# EAGLE schematic CFT-PB0-revD-TSSOP (EAGLE 5.11)
DRAWN_BY: Alexios; PROJECT_NAME: CFT Mini-Computer; REVISION: Rev J; SHEET_DESCRIPTION: But Termination and Buffering; SIMULATION_FILENAME: N/A; URL: http://www.bedroomlan.org/cft

## Sheet 1 of 5
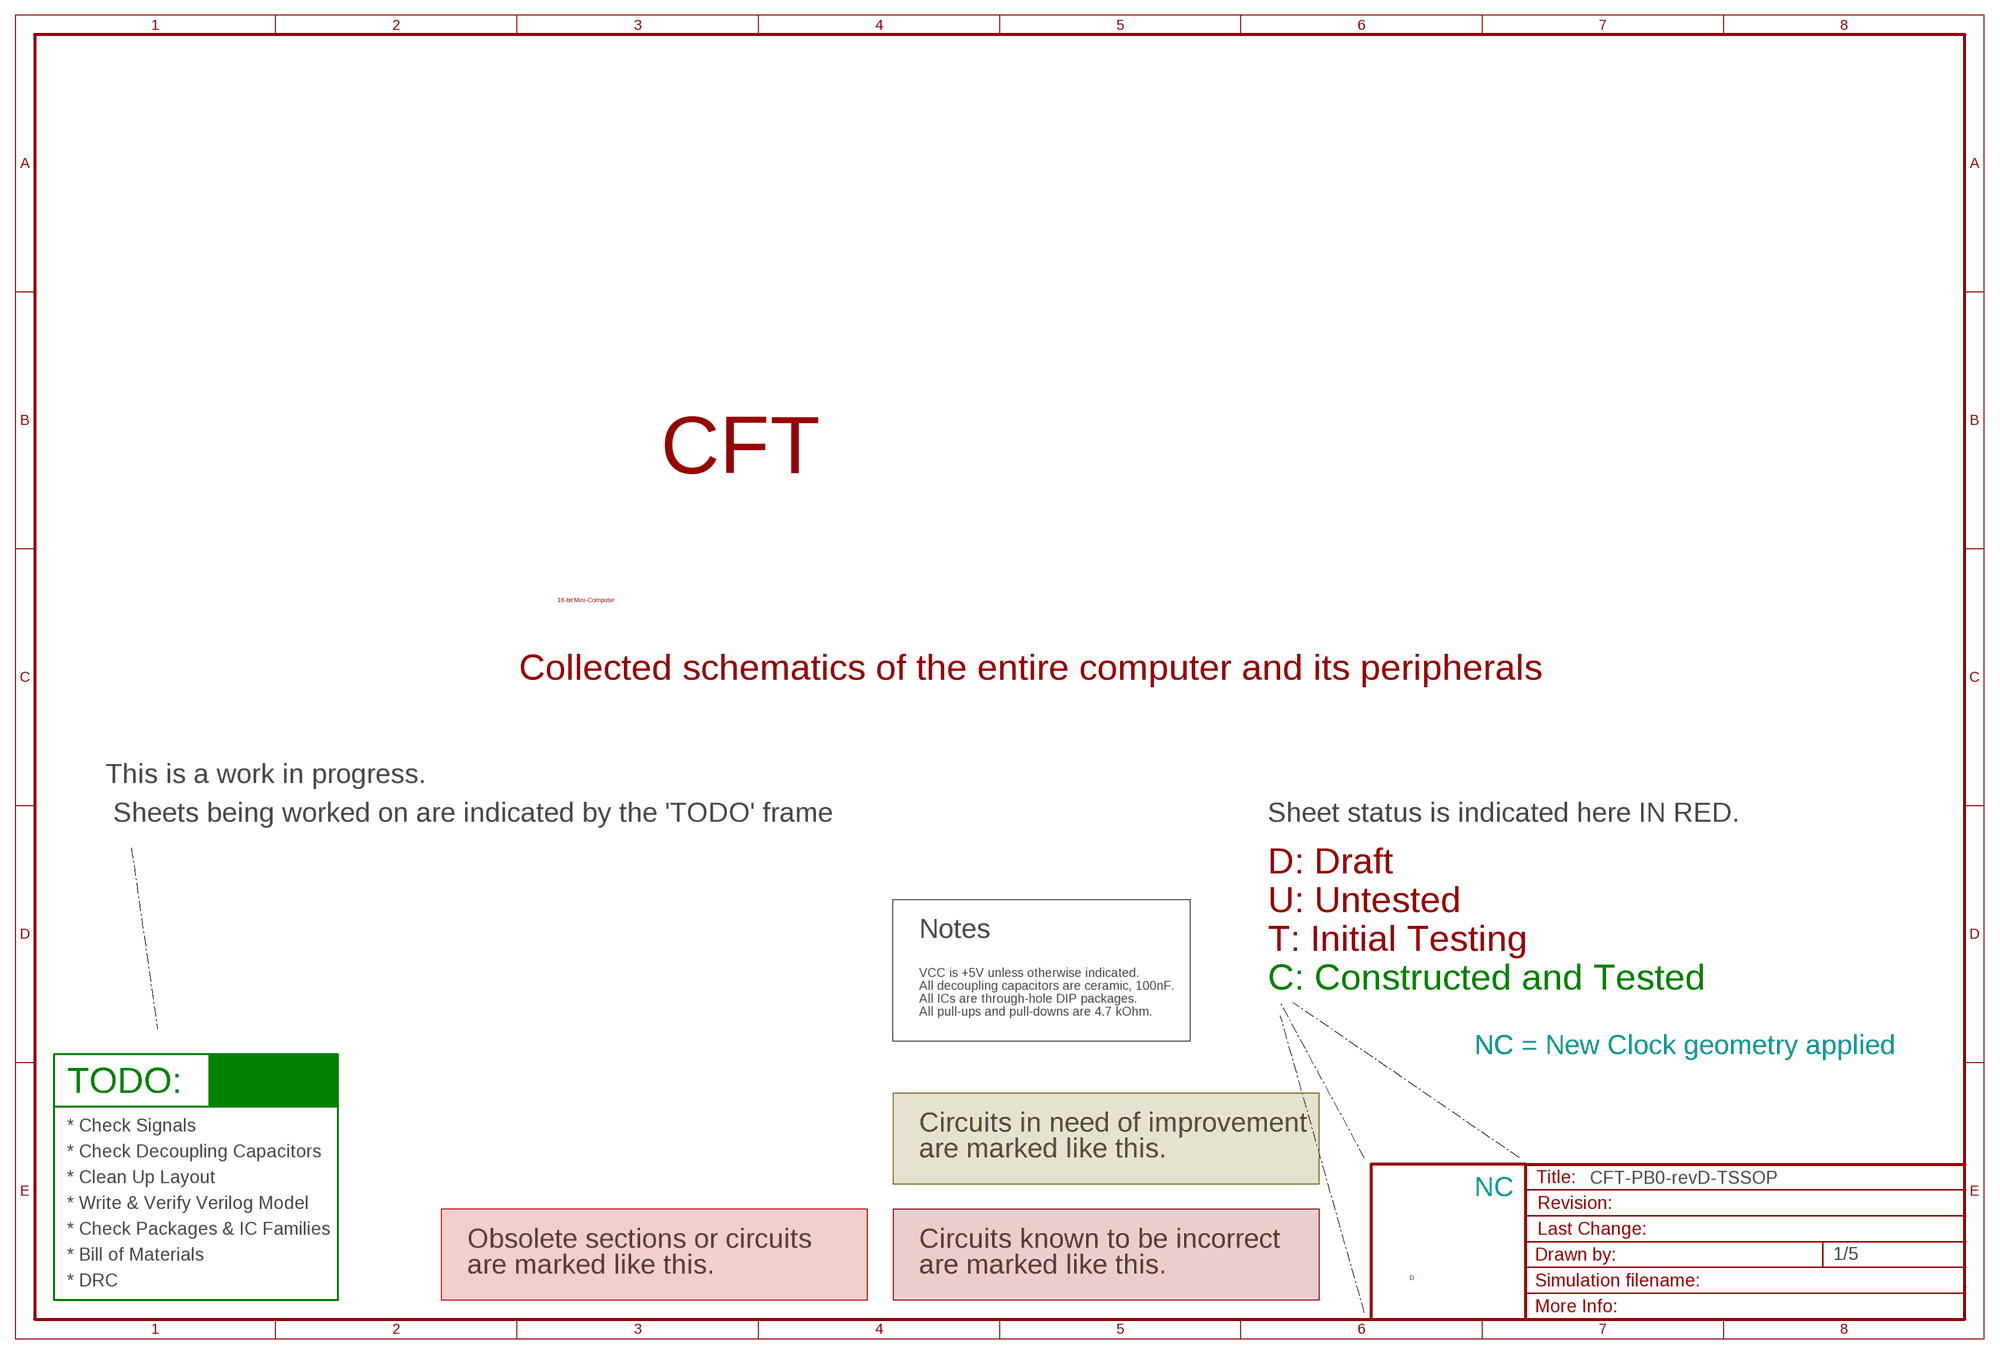
[diagram p0: schematic, sheet 1]

### Notes on the sheet
- CFT
- 16-bit Mini-Computer
- Collected schematics of the entire computer and its peripherals
- This is a work in progress.
- Sheets being worked on are indicated by the 'TODO' frame | Sheet status is indicated here IN RED.
- D: Draft
- U: Untested
- Notes
- T: Initial Testing
- VCC is +5V unless otherwise indicated.
- All decoupling capacitors are ceramic, 100nF. | C: Constructed and Tested
- All ICs are through-hole DIP packages.
- All pull-ups and pull-downs are 4.7 kOhm.
- NC | NC = New Clock geometry applied
- TODO:
- * Check Signals | Circuits in need of improvement
- * Check Decoupling Capacitors | are marked like this.
- * Clean Up Layout
- NC
- * Write & Verify Verilog Model
- * Check Packages & IC Families
- Obsolete sections or circuits | Circuits known to be incorrect
- * Bill of Materials
- are marked like this. | are marked like this.
- D
- * DRC

## Sheet 2 of 5
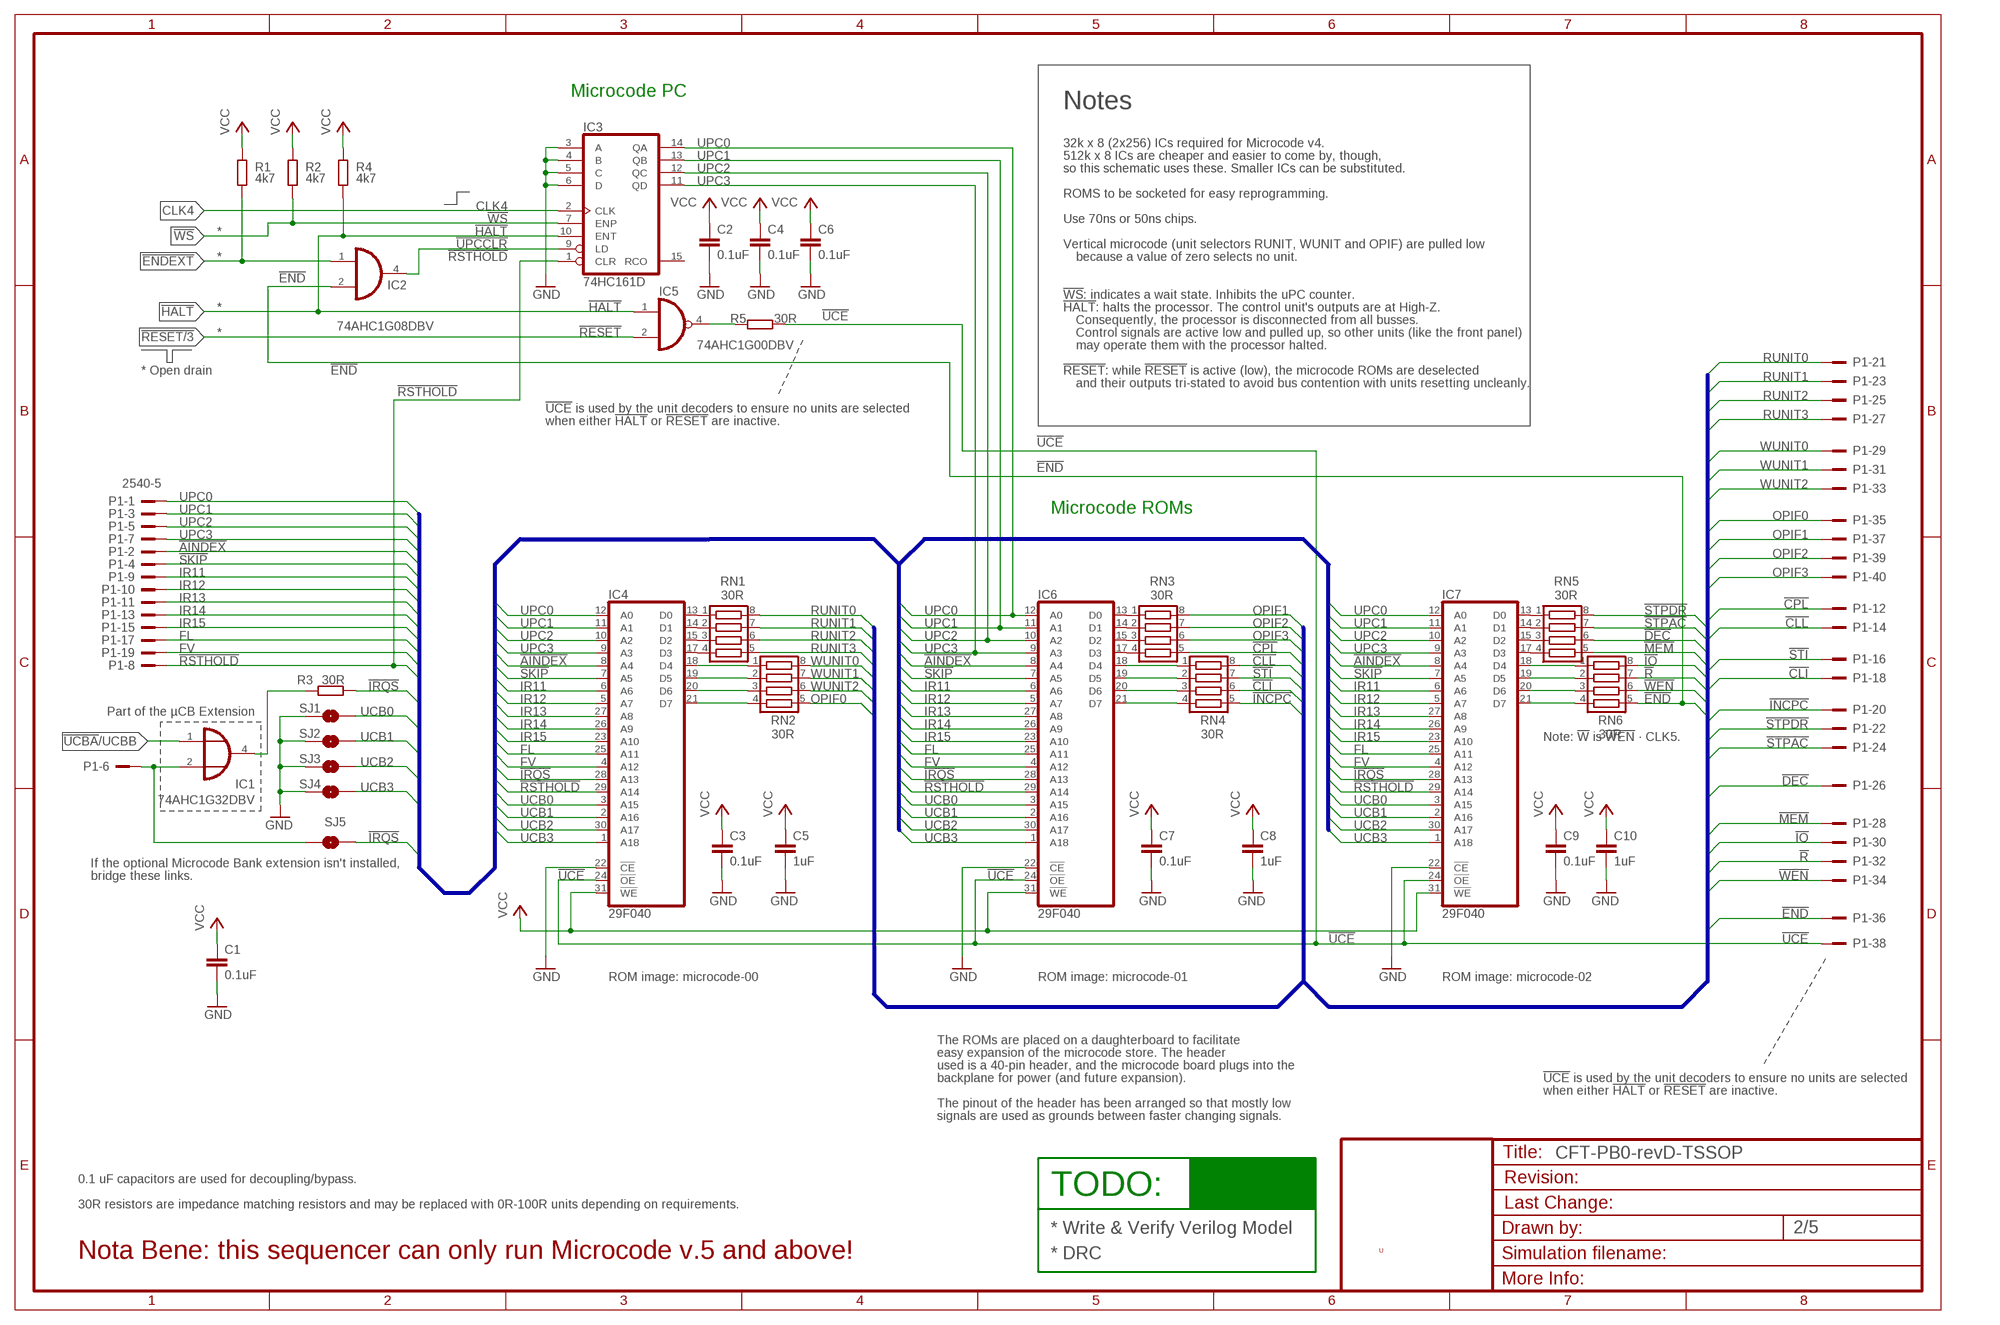
[diagram p1: schematic, sheet 2]

### Parts
C1  0.1uF  C-EUC0805K  [C0805K]
C2  0.1uF  C-EUC0805K  [C0805K]
C3  0.1uF  C-EUC0805K  [C0805K]
C4  0.1uF  C-EUC0805K  [C0805K]
C5  1uF  C-EUC0805K  [C0805K]
C6  0.1uF  C-EUC0805K  [C0805K]
C7  0.1uF  C-EUC0805K  [C0805K]
C8  1uF  C-EUC0805K  [C0805K]
C9  0.1uF  C-EUC0805K  [C0805K]
C10  1uF  C-EUC0805K  [C0805K]
IC1  74AHC1G32DBV  [SOT23-5]
IC2  74AHC1G08DBV  [SOT23-5]
IC3  74HC161D  [SO16D]
IC4  29F040  29F040PLCC32  [PLCC32]
IC5  74AHC1G00DBV  [SOT23-5]
IC6  29F040  29F040PLCC32  [PLCC32]
IC7  29F040  29F040PLCC32  [PLCC32]
P1  2540-5  [PAK100/2500-5-40]
R1  4k7  R-EU_R0805  [R0805]
R2  4k7  R-EU_R0805  [R0805]
R3  30R  R-EU_R0805  [R0805]
R4  4k7  R-EU_R0805  [R0805]
R5  30R  R-EU_R0805  [R0805]
RN1  30R  CTS742C083  [CTS742C083]
RN2  30R  CTS742C083  [CTS742C083]
RN3  30R  CTS742C083  [CTS742C083]
RN4  30R  CTS742C083  [CTS742C083]
RN5  30R  CTS742C083  [CTS742C083]
RN6  30R  CTS742C083  [CTS742C083]
SJ1  SOLDERJUMPER-OLDNO  [SJ_2S-NO]
SJ2  SOLDERJUMPER-OLDNO  [SJ_2S-NO]
SJ3  SOLDERJUMPER-OLDNO  [SJ_2S-NO]
SJ4  SOLDERJUMPER-OLDNO  [SJ_2S-NO]
SJ5  SOLDERJUMPER-OLDNO  [SJ_2S-NO]

### Nets
!AINDEX: IC4.8(A4) IC6.8(A4) IC7.8(A4) P1.2 ; also sheet 4
!CLI: P1.18 RN4.6 ; also sheet 4
!CLL: P1.14 RN4.8 ; also sheet 4
!CPL: P1.12 RN3.5 ; also sheet 4
!DEC: P1.26 RN5.6 ; also sheet 4
!END: IC2.2(I1) P1.36 RN6.5 ; also sheet 3,4
!ENDEXT: IC2.1(I0) R1.1 ; also sheet 5
!HALT: IC3.10(ENT) IC5.1(I0) R4.1 ; also sheet 5
!INCPC: P1.20 RN4.5 ; also sheet 4
!IO: P1.30 RN6.8 ; also sheet 4,5
!IRQS: IC4.28(A13) IC6.28(A13) IC7.28(A13) R3.2 SJ5.1 ; also sheet 4,5
!MEM: P1.28 RN5.5 ; also sheet 4,5
!R: P1.32 RN6.7 ; also sheet 4,5
!RESET: IC5.2(I1) ; also sheet 3,5
!RSTHOLD: IC3.1(CLR) IC4.29(A14) IC6.29(A14) IC7.29(A14) P1.8 ; also sheet 4
!SKIP: IC4.7(A5) IC6.7(A5) IC7.7(A5) P1.4 ; also sheet 4
!STI: P1.16 RN4.7 ; also sheet 4
!STPAC: P1.24 RN5.7 ; also sheet 4
!STPDR: P1.22 RN5.8 ; also sheet 4
!UCBA!/UCBB: IC1.1(I0) ; also sheet 3
!UCE: IC4.24(!OE) IC6.24(!OE) IC7.24(!OE) P1.38 R5.2
!UPCCLR: IC2.4(O) IC3.9(LD)
!WEN: P1.34 RN6.6 ; also sheet 4
!WS: IC3.7(ENP) R2.1 ; also sheet 5
CLK4: IC3.2(CLK) ; also sheet 4,5
FL: IC4.25(A11) IC6.25(A11) IC7.25(A11) P1.17 ; also sheet 4
FV: IC4.4(A12) IC6.4(A12) IC7.4(A12) P1.19 ; also sheet 4
GND [low power]: C1.2 C2.2 C3.2 C4.2 C5.2 C6.2 C7.2 C8.2 C9.2 C10.2 IC3.3(A) IC3.4(B) IC3.5(C) IC3.6(D) IC4.22(!CE) IC6.22(!CE) IC7.22(!CE) SJ1.1 SJ2.1 SJ3.1 SJ4.1 ; also sheet 3,4,5
IR11: IC4.6(A6) IC6.6(A6) IC7.6(A6) P1.9
IR12: IC4.5(A7) IC6.5(A7) IC7.5(A7) P1.10
IR13: IC4.27(A8) IC6.27(A8) IC7.27(A8) P1.11
IR14: IC4.26(A9) IC6.26(A9) IC7.26(A9) P1.13
IR15: IC4.23(A10) IC6.23(A10) IC7.23(A10) P1.15
N$45: IC5.4(O) R5.1
N$46: IC4.14(D1) RN1.2
N$47: IC1.4(O) R3.1
N$48: IC1.2(I1) P1.6 SJ5.2
N$49: IC4.15(D2) RN1.3
N$50: IC4.17(D3) RN1.4
N$51: IC4.13(D0) RN1.1
N$52: IC4.19(D5) RN2.2
N$53: IC4.20(D6) RN2.3
N$54: IC4.21(D7) RN2.4
N$55: IC4.18(D4) RN2.1
N$56: IC6.14(D1) RN3.2
N$57: IC6.15(D2) RN3.3
N$58: IC6.17(D3) RN3.4
N$59: IC6.13(D0) RN3.1
N$60: IC6.19(D5) RN4.2
N$61: IC7.14(D1) RN5.2
N$62: IC7.15(D2) RN5.3
N$63: IC7.17(D3) RN5.4
N$64: IC7.13(D0) RN5.1
N$65: IC7.19(D5) RN6.2
N$66: IC7.20(D6) RN6.3
N$67: IC7.21(D7) RN6.4
N$68: IC7.18(D4) RN6.1
N$69: IC6.20(D6) RN4.3
N$70: IC6.21(D7) RN4.4
N$71: IC6.18(D4) RN4.1
OPIF0: P1.35 RN2.5 ; also sheet 4
OPIF1: P1.37 RN3.8 ; also sheet 4
OPIF2: P1.39 RN3.7 ; also sheet 4
OPIF3: P1.40 RN3.6 ; also sheet 4
RUNIT0: P1.21 RN1.8 ; also sheet 4
RUNIT1: P1.23 RN1.7 ; also sheet 4
RUNIT2: P1.25 RN1.6 ; also sheet 4
RUNIT3: P1.27 RN1.5 ; also sheet 4
UCB0: IC4.3(A15) IC6.3(A15) IC7.3(A15) SJ1.2 ; also sheet 3,4
UCB1: IC4.2(A16) IC6.2(A16) IC7.2(A16) SJ2.2 ; also sheet 3,4
UCB2: IC4.30(A17) IC6.30(A17) IC7.30(A17) SJ3.2 ; also sheet 3,4
UCB3: IC4.1(A18) IC6.1(A18) IC7.1(A18) SJ4.2 ; also sheet 3,4
UPC0: IC3.14(QA) IC4.12(A0) IC6.12(A0) IC7.12(A0) P1.1 ; also sheet 4
UPC1: IC3.13(QB) IC4.11(A1) IC6.11(A1) IC7.11(A1) P1.3 ; also sheet 4
UPC2: IC3.12(QC) IC4.10(A2) IC6.10(A2) IC7.10(A2) P1.5 ; also sheet 4
UPC3: IC3.11(QD) IC4.9(A3) IC6.9(A3) IC7.9(A3) P1.7 ; also sheet 4
VCC [low power]: C1.1 C2.1 C3.1 C4.1 C5.1 C6.1 C7.1 C8.1 C9.1 C10.1 IC4.31(!WE) IC6.31(!WE) IC7.31(!WE) R1.2 R2.2 R4.2 ; also sheet 3,4,5
WUNIT0: P1.29 RN2.8 ; also sheet 4
WUNIT1: P1.31 RN2.7 ; also sheet 4
WUNIT2: P1.33 RN2.6 ; also sheet 4
Unconnected: IC3.15(RCO)

### Buses
MCINSTR:RUNIT[0..3],WUNIT[0..2],OPIF[0..3],!CPL,!CLL,!STI,!CLI,!INCPC,!STPDR,!STPAC,!DEC,!MEM,!IO,!R,!W,!END
MCADDR:UPC[0..3],!AINDEX,!SKIP,IR[11..15],FL,FV,!IRQS,!RSTHOLD,UCB[0..3]

### Notes on the sheet
- Microcode PC
- Notes
- 32k x 8 (2x256) ICs required for Microcode v4.
- 512k x 8 ICs are cheaper and easier to come by, though,
- so this schematic uses these. Smaller ICs can be substituted.
- ROMS to be socketed for easy reprogramming.
- Use 70ns or 50ns chips.
- *
- Vertical microcode (unit selectors RUNIT, WUNIT and OPIF) are pulled low
- * | because a value of zero selects no unit.
- !WS!: indicates a wait state. Inhibits the uPC counter.
- * | !HALT!: halts the processor. The control unit's outputs are at High-Z.
- Consequently, the processor is disconnected from all busses.
- * | Control signals are active low and pulled up, so other units (like the front panel)
- may operate them with the processor halted.
- * Open drain | !RESET!: while !RESET! is active (low), the microcode ROMs are deselected
- and their outputs tri-stated to avoid bus contention with units resetting uncleanly.
- !UCE! is used by the unit decoders to ensure no units are selected
- when either !HALT! or !RESET! are inactive.
- Microcode ROMs
- Part of the µCB Extension
- Note: !W! is !WEN! · CLK5.
- If the optional Microcode Bank extension isn't installed,
- bridge these links.
- ROM image: microcode-00 | ROM image: microcode-01 | ROM image: microcode-02
- The ROMs are placed on a daughterboard to facilitate
- easy expansion of the microcode store. The header
- used is a 40-pin header, and the microcode board plugs into the
- backplane for power (and future expansion). | !UCE! is used by the unit decoders to ensure no units are selected
- when either !HALT! or !RESET! are inactive.
- The pinout of the header has been arranged so that mostly low
- signals are used as grounds between faster changing signals.
- 0.1 uF capacitors are used for decoupling/bypass.
- TODO:
- 30R resistors are impedance matching resistors and may be replaced with 0R-100R units depending on requirements.
- * Write & Verify Verilog Model
- U
- Nota Bene: this sequencer can only run Microcode v.5 and above! | * DRC

## Sheet 3 of 5
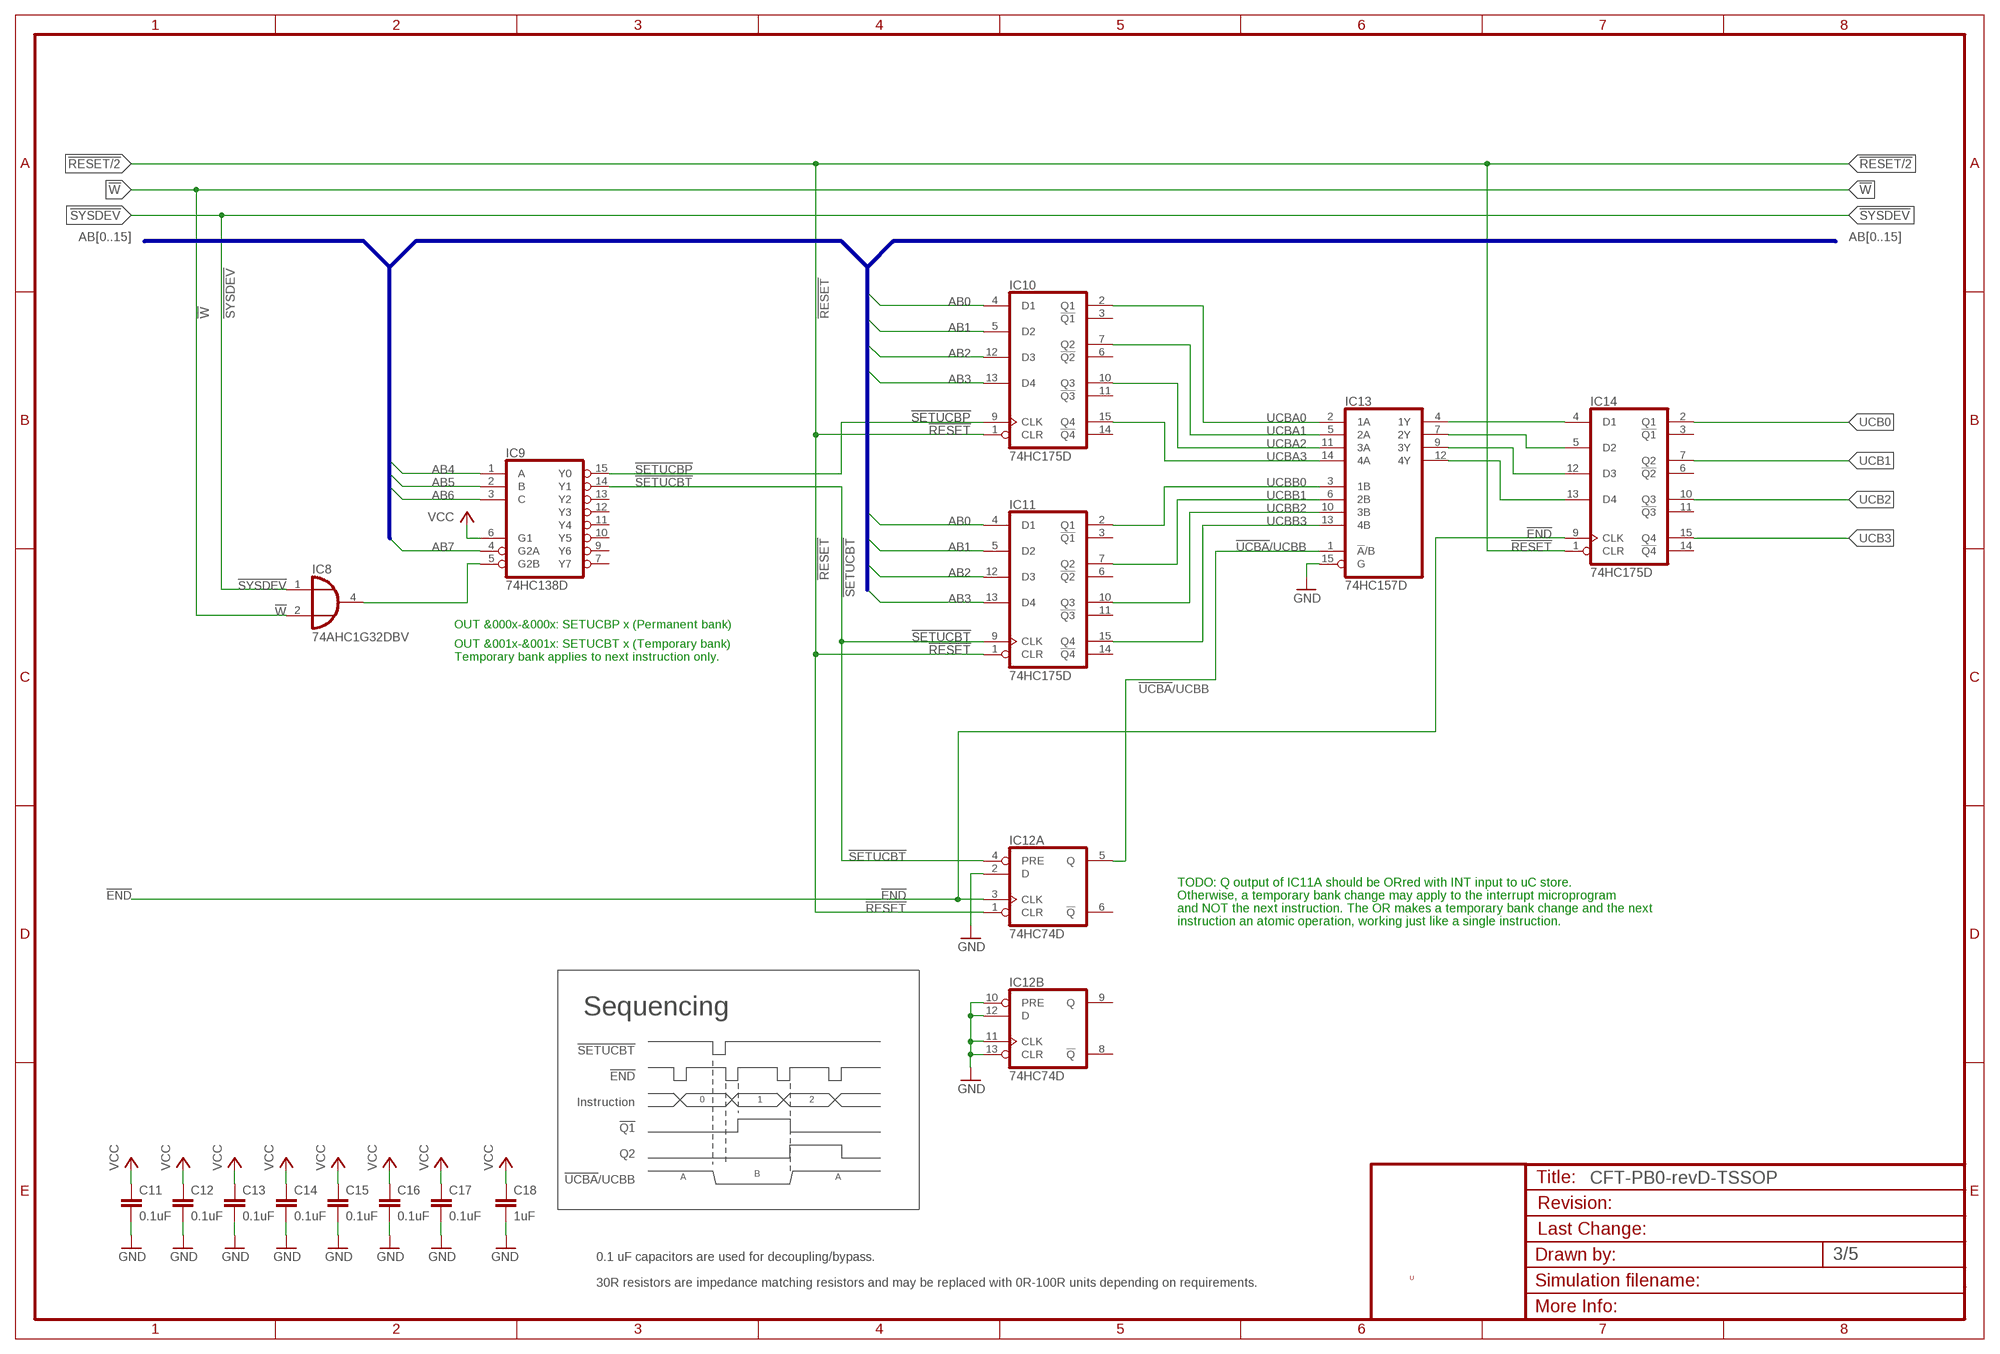
[diagram p2: schematic, sheet 3]

### Parts
C11  0.1uF  C-EUC0805K  [C0805K]
C12  0.1uF  C-EUC0805K  [C0805K]
C13  0.1uF  C-EUC0805K  [C0805K]
C14  0.1uF  C-EUC0805K  [C0805K]
C15  0.1uF  C-EUC0805K  [C0805K]
C16  0.1uF  C-EUC0805K  [C0805K]
C17  0.1uF  C-EUC0805K  [C0805K]
C18  1uF  C-EUC0805K  [C0805K]
IC8  74AHC1G32DBV  [SOT23-5]
IC9  74HC138D  [SO16]
IC10  74HC175D  [SO16]
IC11  74HC175D  [SO16]
IC12  74HC74D  [SO14]
IC13  74HC157D  74HC157/ALT-D  [SO16]
IC14  74HC175D  [SO16]

### Nets
!END: IC12.3(A:CLK) IC14.9(CLK) ; also sheet 2,4
!RESET: IC10.1(CLR) IC11.1(CLR) IC12.1(A:CLR) IC14.1(CLR) ; also sheet 2,5
!SETUCBP: IC9.15(Y0) IC10.9(CLK)
!SETUCBT: IC9.14(Y1) IC11.9(CLK) IC12.4(A:PRE)
!SYSDEV: IC8.1(I0) ; also sheet 4,5
!UCBA!/UCBB: IC12.5(A:Q) IC13.1(!A!/B) ; also sheet 2
!W: IC8.2(I1) ; also sheet 4,5
AB0: IC10.4(D1) IC11.4(D1) ; also sheet 4,5
AB1: IC10.5(D2) IC11.5(D2) ; also sheet 4,5
AB2: IC10.12(D3) IC11.12(D3) ; also sheet 4,5
AB3: IC10.13(D4) IC11.13(D4) ; also sheet 4,5
AB4: IC9.1(A) ; also sheet 4,5
AB5: IC9.2(B) ; also sheet 4,5
AB6: IC9.3(C) ; also sheet 4,5
AB7: IC9.4(G2A) ; also sheet 4,5
GND [low power]: C11.2 C12.2 C13.2 C14.2 C15.2 C16.2 C17.2 C18.2 IC12.2(A:D) IC12.10(B:PRE) IC12.11(B:CLK) IC12.12(B:D) IC12.13(B:CLR) IC13.15(G) ; also sheet 2,4,5
N$1: IC8.4(O) IC9.5(G2B)
N$2: IC13.4(1Y) IC14.4(D1)
N$3: IC13.7(2Y) IC14.5(D2)
N$4: IC13.9(3Y) IC14.12(D3)
N$5: IC13.12(4Y) IC14.13(D4)
UCB0: IC14.2(Q1) ; also sheet 2,4
UCB1: IC14.7(Q2) ; also sheet 2,4
UCB2: IC14.10(Q3) ; also sheet 2,4
UCB3: IC14.15(Q4) ; also sheet 2,4
UCBA0: IC10.2(Q1) IC13.2(1A)
UCBA1: IC10.7(Q2) IC13.5(2A)
UCBA2: IC10.10(Q3) IC13.11(3A)
UCBA3: IC10.15(Q4) IC13.14(4A)
UCBB0: IC11.2(Q1) IC13.3(1B)
UCBB1: IC11.7(Q2) IC13.6(2B)
UCBB2: IC11.10(Q3) IC13.10(3B)
UCBB3: IC11.15(Q4) IC13.13(4B)
VCC [low power]: C11.1 C12.1 C13.1 C14.1 C15.1 C16.1 C17.1 C18.1 IC9.6(G1) ; also sheet 2,4,5
Unconnected: IC9.7(Y7) IC9.9(Y6) IC9.10(Y5) IC9.11(Y4) IC9.12(Y3) IC9.13(Y2) IC10.3(!Q1) IC10.6(!Q2) IC10.11(!Q3) IC10.14(!Q4) IC11.3(!Q1) IC11.6(!Q2) IC11.11(!Q3) IC11.14(!Q4) IC12.6(A:!Q) IC12.8(B:!Q) IC12.9(B:Q) IC14.3(!Q1) IC14.6(!Q2) IC14.11(!Q3) IC14.14(!Q4)

### Buses
AB[0..15]

### Notes on the sheet
- OUT &000x-&000x: SETUCBP x (Permanent bank)
- OUT &001x-&001x: SETUCBT x (Temporary bank)
- Temporary bank applies to next instruction only.
- TODO: Q output of IC11A should be ORred with INT input to uC store.
- Otherwise, a temporary bank change may apply to the interrupt microprogram
- and NOT the next instruction. The OR makes a temporary bank change and the next
- instruction an atomic operation, working just like a single instruction.
- Sequencing
- !SETUCBT
- !END
- 0 | 1 | 2
- Instruction
- !Q1
- Q2
- B
- A | A
- !UCBA!/UCBB
- 0.1 uF capacitors are used for decoupling/bypass.
- U
- 30R resistors are impedance matching resistors and may be replaced with 0R-100R units depending on requirements.

## Sheet 4 of 5
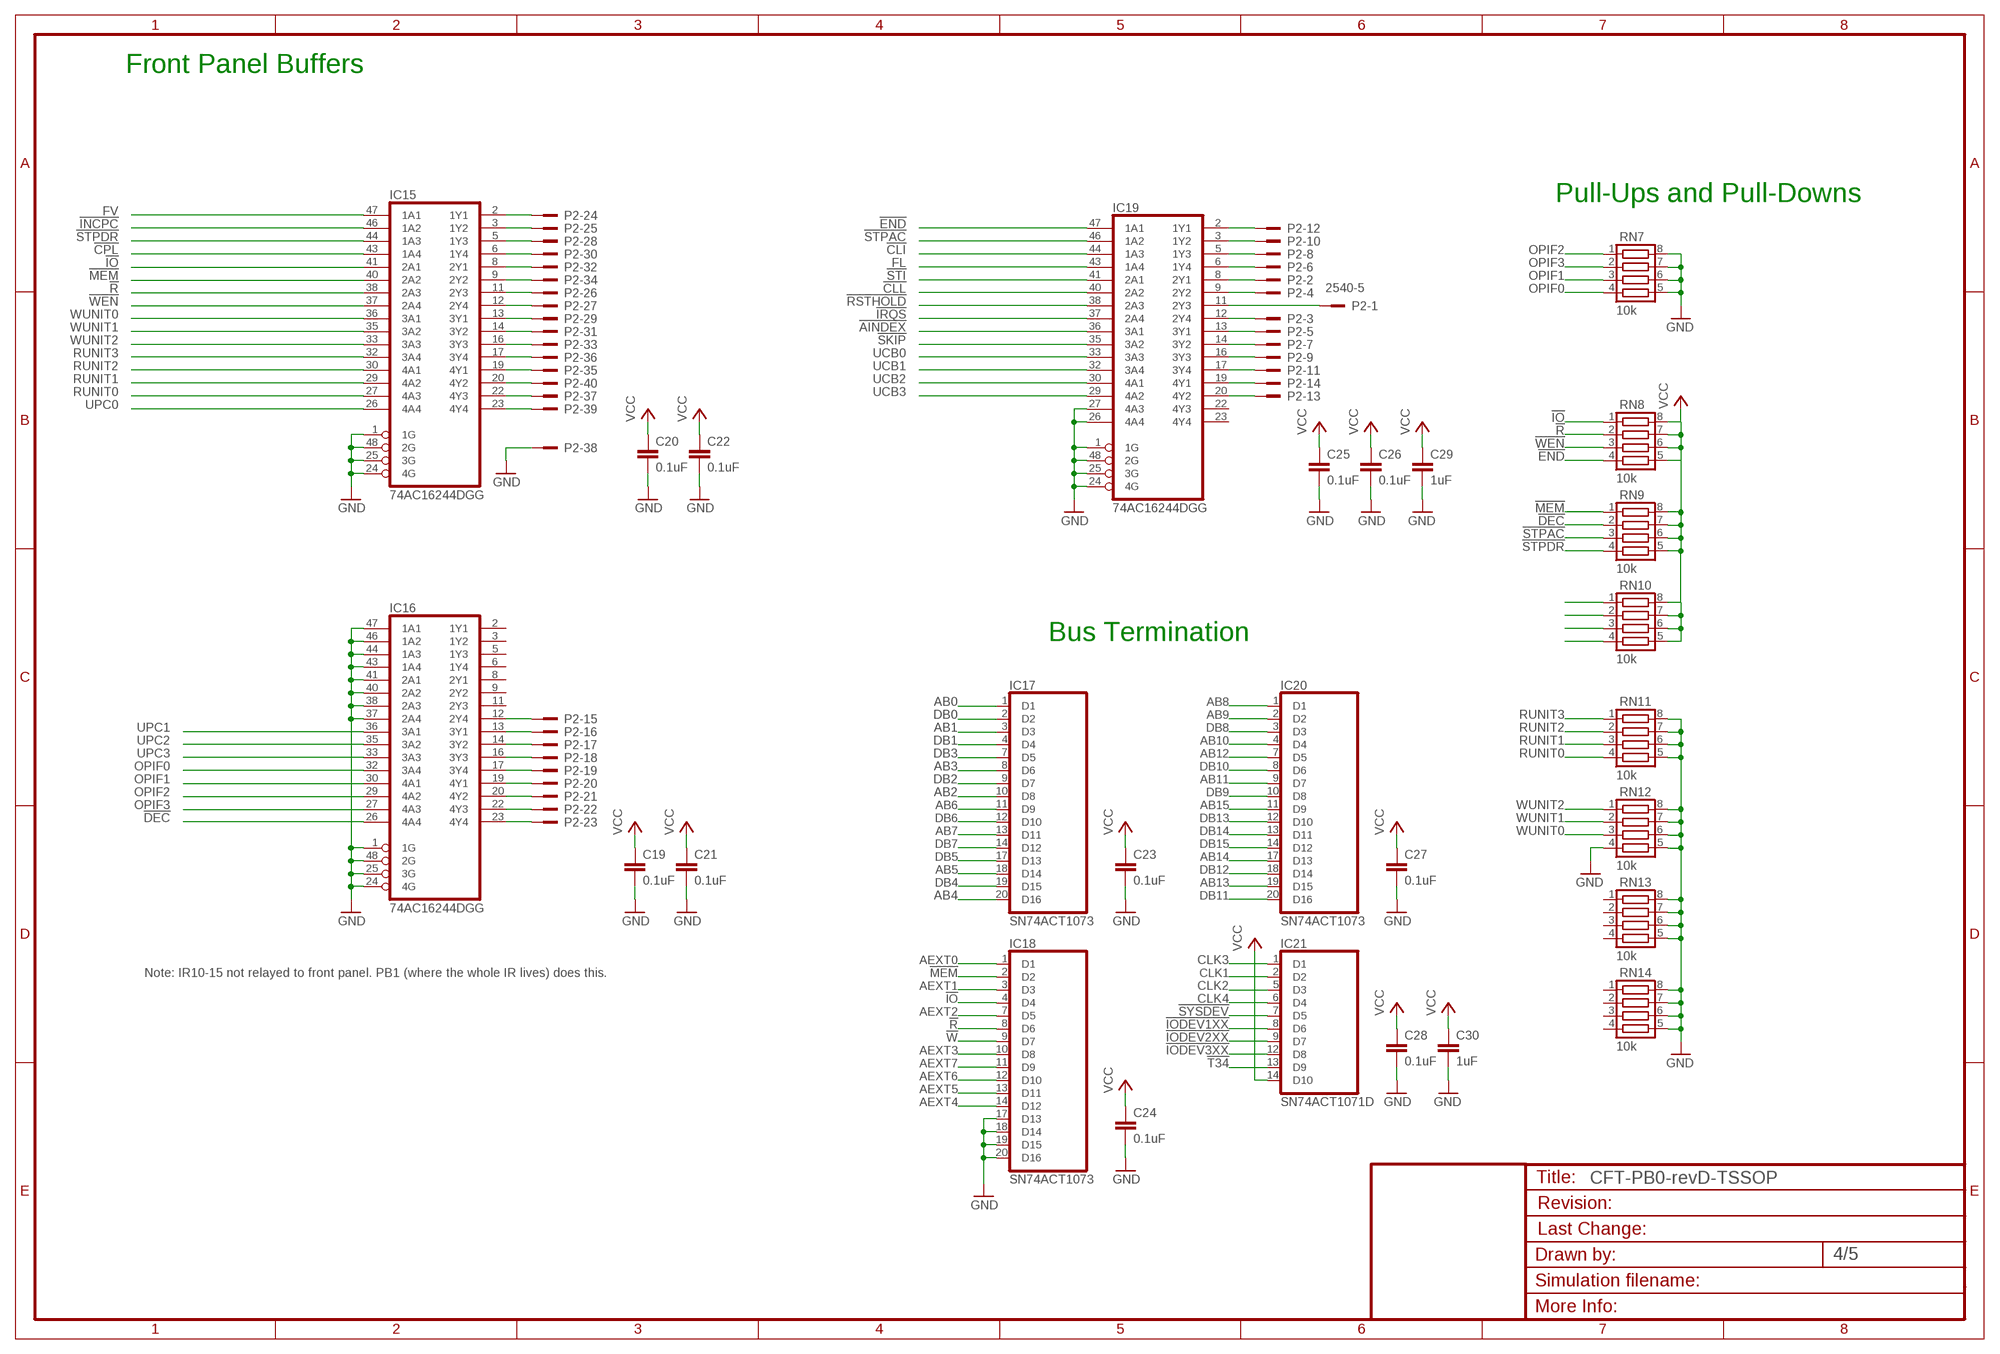
[diagram p3: schematic, sheet 4]

### Parts
C19  0.1uF  C-EUC0805K  [C0805K]
C20  0.1uF  C-EUC0805K  [C0805K]
C21  0.1uF  C-EUC0805K  [C0805K]
C22  0.1uF  C-EUC0805K  [C0805K]
C23  0.1uF  C-EUC0805K  [C0805K]
C24  0.1uF  C-EUC0805K  [C0805K]
C25  0.1uF  C-EUC0805K  [C0805K]
C26  0.1uF  C-EUC0805K  [C0805K]
C27  0.1uF  C-EUC0805K  [C0805K]
C28  0.1uF  C-EUC0805K  [C0805K]
C29  1uF  C-EUC0805K  [C0805K]
C30  1uF  C-EUC0805K  [C0805K]
IC15  74AC16244DGG  [TSSOP-48]
IC16  74AC16244DGG  [TSSOP-48]
IC17  SN74ACT1073  [SO20W]
IC18  SN74ACT1073  [SO20W]
IC19  74AC16244DGG  [TSSOP-48]
IC20  SN74ACT1073  [SO20W]
IC21  SN74ACT1071D  [SO14]
P2  2540-5  [PAK100/2500-5-40]
RN7  10k  CTS742C083  [CTS742C083]
RN8  10k  CTS742C083  [CTS742C083]
RN9  10k  CTS742C083  [CTS742C083]
RN10  10k  CTS742C083  [CTS742C083]
RN11  10k  CTS742C083  [CTS742C083]
RN12  10k  CTS742C083  [CTS742C083]
RN13  10k  CTS742C083  [CTS742C083]
RN14  10k  CTS742C083  [CTS742C083]

### Nets
!AINDEX: IC19.36(3A1) ; also sheet 2
!CLI: IC19.44(1A3) ; also sheet 2
!CLL: IC19.40(2A2) ; also sheet 2
!CPL: IC15.43(1A4) ; also sheet 2
!DEC: IC16.26(4A4) RN9.2 ; also sheet 2
!END: IC19.47(1A1) RN8.4 ; also sheet 2,3
!INCPC: IC15.46(1A2) ; also sheet 2
!IO: IC15.41(2A1) IC18.4(D4) RN8.1 ; also sheet 2,5
!IODEV1XX: IC21.8(D6) ; also sheet 5
!IODEV2XX: IC21.9(D7) ; also sheet 5
!IODEV3XX: IC21.12(D8) ; also sheet 5
!IRQS: IC19.37(2A4) ; also sheet 2,5
!MEM: IC15.40(2A2) IC18.2(D2) RN9.1 ; also sheet 2,5
!R: IC15.38(2A3) IC18.8(D6) RN8.2 ; also sheet 2,5
!RSTHOLD: IC19.38(2A3) ; also sheet 2
!SKIP: IC19.35(3A2) ; also sheet 2
!STI: IC19.41(2A1) ; also sheet 2
!STPAC: IC19.46(1A2) RN9.3 ; also sheet 2
!STPDR: IC15.44(1A3) RN9.4 ; also sheet 2
!SYSDEV: IC21.7(D5) ; also sheet 3,5
!T34: IC21.13(D9) ; also sheet 5
!W: IC18.9(D7) ; also sheet 3,5
!WEN: IC15.37(2A4) RN8.3 ; also sheet 2
AB0: IC17.1(D1) ; also sheet 3,5
AB1: IC17.3(D3) ; also sheet 3,5
AB2: IC17.10(D8) ; also sheet 3,5
AB3: IC17.8(D6) ; also sheet 3,5
AB4: IC17.20(D16) ; also sheet 3,5
AB5: IC17.18(D14) ; also sheet 3,5
AB6: IC17.11(D9) ; also sheet 3,5
AB7: IC17.13(D11) ; also sheet 3,5
AB8: IC20.1(D1) ; also sheet 5
AB9: IC20.2(D2) ; also sheet 5
AB10: IC20.4(D4) ; also sheet 5
AB11: IC20.9(D7) ; also sheet 5
AB12: IC20.7(D5) ; also sheet 5
AB13: IC20.19(D15) ; also sheet 5
AB14: IC20.17(D13) ; also sheet 5
AB15: IC20.11(D9) ; also sheet 5
AEXT0: IC18.1(D1) ; also sheet 5
AEXT1: IC18.3(D3) ; also sheet 5
AEXT2: IC18.7(D5) ; also sheet 5
AEXT3: IC18.10(D8) ; also sheet 5
AEXT4: IC18.14(D12) ; also sheet 5
AEXT5: IC18.13(D11) ; also sheet 5
AEXT6: IC18.12(D10) ; also sheet 5
AEXT7: IC18.11(D9) ; also sheet 5
CLK1: IC21.2(D2) ; also sheet 5
CLK2: IC21.5(D3) ; also sheet 5
CLK3: IC21.1(D1) ; also sheet 5
CLK4: IC21.6(D4) ; also sheet 2,5
DB0: IC17.2(D2) ; also sheet 5
DB1: IC17.4(D4) ; also sheet 5
DB2: IC17.9(D7) ; also sheet 5
DB3: IC17.7(D5) ; also sheet 5
DB4: IC17.19(D15) ; also sheet 5
DB5: IC17.17(D13) ; also sheet 5
DB6: IC17.12(D10) ; also sheet 5
DB7: IC17.14(D12) ; also sheet 5
DB8: IC20.3(D3) ; also sheet 5
DB9: IC20.10(D8) ; also sheet 5
DB10: IC20.8(D6) ; also sheet 5
DB11: IC20.20(D16) ; also sheet 5
DB12: IC20.18(D14) ; also sheet 5
DB13: IC20.12(D10) ; also sheet 5
DB14: IC20.13(D11) ; also sheet 5
DB15: IC20.14(D12) ; also sheet 5
FL: IC19.43(1A4) ; also sheet 2
FV: IC15.47(1A1) ; also sheet 2
GND [low power]: C19.2 C20.2 C21.2 C22.2 C23.2 C24.2 C25.2 C26.2 C27.2 C28.2 C29.2 C30.2 IC15.1(1G) IC15.24(4G) IC15.25(3G) IC15.48(2G) IC16.1(1G) IC16.24(4G) IC16.25(3G) IC16.37(2A4) IC16.38(2A3) IC16.40(2A2) IC16.41(2A1) IC16.43(1A4) IC16.44(1A3) IC16.46(1A2) IC16.47(1A1) IC16.48(2G) IC18.17(D13) IC18.18(D14) IC18.19(D15) IC18.20(D16) IC19.1(1G) IC19.24(4G) IC19.25(3G) IC19.26(4A4) IC19.27(4A3) IC19.48(2G) P2.38 RN7.5 RN7.6 RN7.7 RN7.8 RN11.5 RN11.6 RN11.7 RN11.8 RN12.4 RN12.5 RN12.6 RN12.7 RN12.8 RN13.5 RN13.6 RN13.7 RN13.8 RN14.5 RN14.6 RN14.7 RN14.8 ; also sheet 2,3,5
N$6: IC15.23(4Y4) P2.39
N$7: IC15.22(4Y3) P2.37
N$8: IC15.20(4Y2) P2.40
N$9: IC15.19(4Y1) P2.35
N$10: IC19.2(1Y1) P2.12
N$11: IC19.3(1Y2) P2.10
N$12: IC19.9(2Y2) P2.4
N$13: IC19.8(2Y1) P2.2
N$14: IC19.6(1Y4) P2.6
N$15: IC19.5(1Y3) P2.8
N$16: IC19.11(2Y3) P2.1
N$17: IC19.12(2Y4) P2.3
N$18: IC19.13(3Y1) P2.5
N$19: IC19.14(3Y2) P2.7
N$20: IC19.16(3Y3) P2.9
N$21: IC19.17(3Y4) P2.11
N$22: IC19.20(4Y2) P2.13
N$23: IC19.19(4Y1) P2.14
N$24: IC15.17(3Y4) P2.36
N$25: IC15.16(3Y3) P2.33
N$26: IC15.14(3Y2) P2.31
N$27: IC15.13(3Y1) P2.29
N$28: IC15.12(2Y4) P2.27
N$29: IC15.11(2Y3) P2.26
N$30: IC15.9(2Y2) P2.34
N$31: IC15.8(2Y1) P2.32
N$32: IC15.6(1Y4) P2.30
N$33: IC15.5(1Y3) P2.28
N$34: IC15.3(1Y2) P2.25
N$35: IC15.2(1Y1) P2.24
N$36: IC16.23(4Y4) P2.23
N$37: IC16.22(4Y3) P2.22
N$38: IC16.20(4Y2) P2.21
N$39: IC16.19(4Y1) P2.20
N$40: IC16.17(3Y4) P2.19
N$41: IC16.16(3Y3) P2.18
N$42: IC16.14(3Y2) P2.17
N$43: IC16.13(3Y1) P2.16
N$44: IC16.12(2Y4) P2.15
N$83: RN10.1
N$84: RN10.2
N$85: RN10.3
N$86: RN10.4
OPIF0: IC16.32(3A4) RN7.4 ; also sheet 2
OPIF1: IC16.30(4A1) RN7.3 ; also sheet 2
OPIF2: IC16.29(4A2) RN7.1 ; also sheet 2
OPIF3: IC16.27(4A3) RN7.2 ; also sheet 2
RUNIT0: IC15.27(4A3) RN11.4 ; also sheet 2
RUNIT1: IC15.29(4A2) RN11.3 ; also sheet 2
RUNIT2: IC15.30(4A1) RN11.2 ; also sheet 2
RUNIT3: IC15.32(3A4) RN11.1 ; also sheet 2
UCB0: IC19.33(3A3) ; also sheet 2,3
UCB1: IC19.32(3A4) ; also sheet 2,3
UCB2: IC19.30(4A1) ; also sheet 2,3
UCB3: IC19.29(4A2) ; also sheet 2,3
UPC0: IC15.26(4A4) ; also sheet 2
UPC1: IC16.36(3A1) ; also sheet 2
UPC2: IC16.35(3A2) ; also sheet 2
UPC3: IC16.33(3A3) ; also sheet 2
VCC [low power]: C19.1 C20.1 C21.1 C22.1 C23.1 C24.1 C25.1 C26.1 C27.1 C28.1 C29.1 C30.1 IC21.14(D10) RN8.5 RN8.6 RN8.7 RN8.8 RN9.5 RN9.6 RN9.7 RN9.8 RN10.5 RN10.6 RN10.7 RN10.8 ; also sheet 2,3,5
WUNIT0: IC15.36(3A1) RN12.3 ; also sheet 2
WUNIT1: IC15.35(3A2) RN12.2 ; also sheet 2
WUNIT2: IC15.33(3A3) RN12.1 ; also sheet 2
Unconnected: IC16.2(1Y1) IC16.3(1Y2) IC16.5(1Y3) IC16.6(1Y4) IC16.8(2Y1) IC16.9(2Y2) IC16.11(2Y3) IC19.22(4Y3) IC19.23(4Y4) RN13.1 RN13.2 RN13.3 RN13.4 RN14.1 RN14.2 RN14.3 RN14.4

### Notes on the sheet
- Front Panel Buffers
- Pull-Ups and Pull-Downs
- Bus Termination
- Note: IR10-15 not relayed to front panel. PB1 (where the whole IR lives) does this.

## Sheet 5 of 5
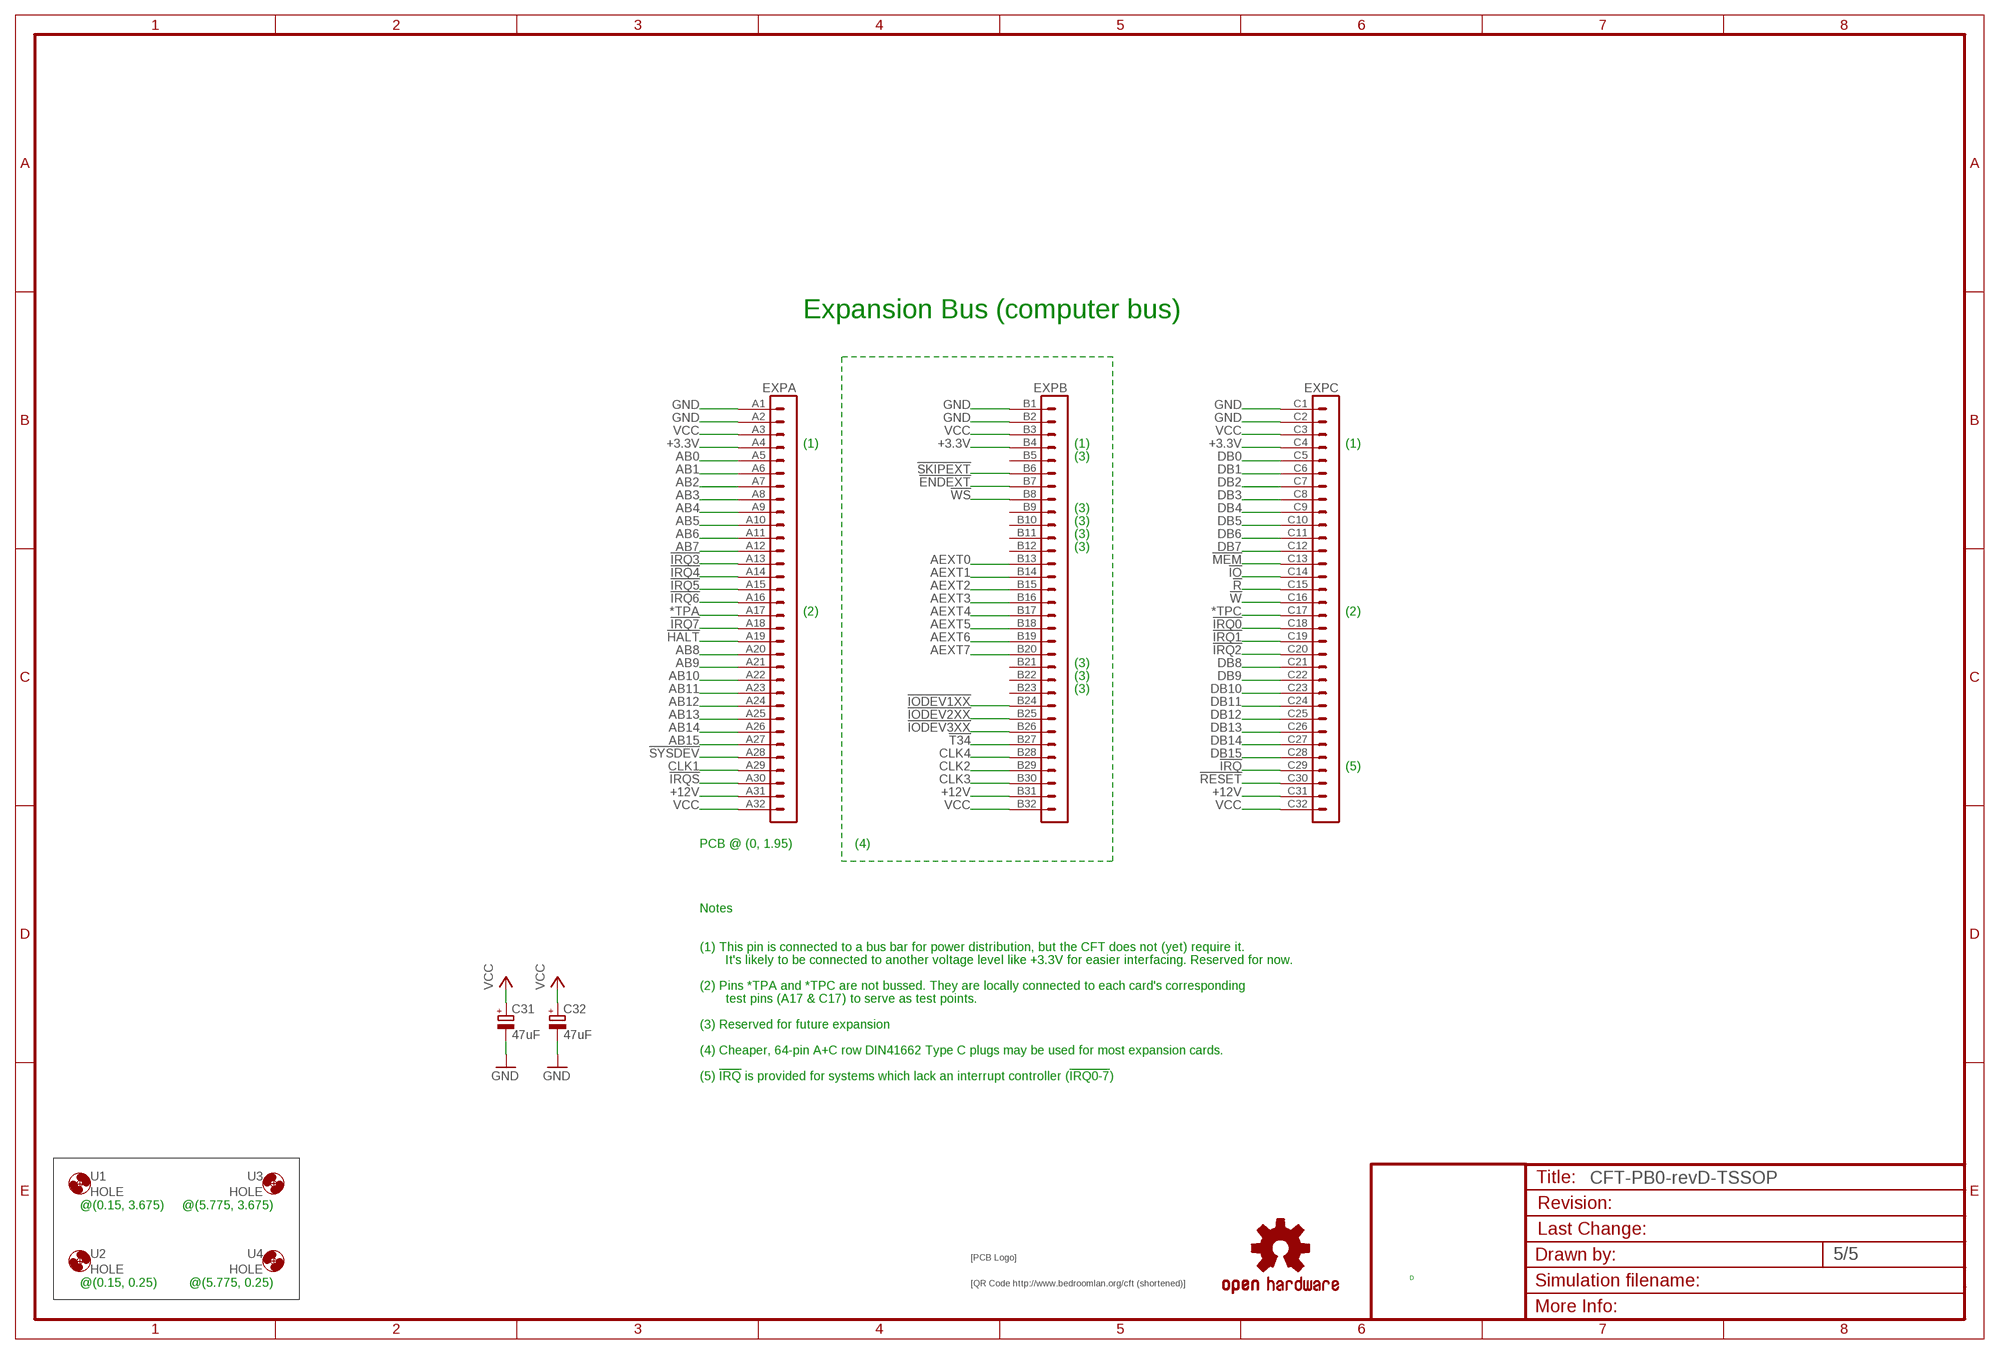
[diagram p4: schematic, sheet 5]

### Parts
$4_37_$  SIGNATURESILK  [SIGNATURE]
$4_39_$  OSHW-LOGOL  [OSHW-LOGO-L]
$4_40_$  QRCODE-CFT  [CFT-QRCODE]
C31  47uF  CPOL-EUE2.5-5  [E2,5-5]
C32  47uF  CPOL-EUE2.5-5  [E2,5-5]
EXP  VG96-3K  [VG96K]
U1  HOLE  [STANDOFF_28_60]
U2  HOLE  [STANDOFF_28_60]
U3  HOLE  [STANDOFF_28_60]
U4  HOLE  [STANDOFF_28_60]

### Nets
!ENDEXT: EXP.B7 ; also sheet 2
!HALT: EXP.A19 ; also sheet 2
!IO: EXP.C14 ; also sheet 2,4
!IODEV1XX: EXP.B24 ; also sheet 4
!IODEV2XX: EXP.B25 ; also sheet 4
!IODEV3XX: EXP.B26 ; also sheet 4
!IRQ: EXP.C29
!IRQ0: EXP.C18
!IRQ1: EXP.C19
!IRQ2: EXP.C20
!IRQ3: EXP.A13
!IRQ4: EXP.A14
!IRQ5: EXP.A15
!IRQ6: EXP.A16
!IRQ7: EXP.A18
!IRQS: EXP.A30 ; also sheet 2,4
!MEM: EXP.C13 ; also sheet 2,4
!R: EXP.C15 ; also sheet 2,4
!RESET: EXP.C30 ; also sheet 2,3
!SKIPEXT: EXP.B6
!SYSDEV: EXP.A28 ; also sheet 3,4
!T34: EXP.B27 ; also sheet 4
!W: EXP.C16 ; also sheet 3,4
!WS: EXP.B8 ; also sheet 2
*TPA: EXP.A17
*TPC: EXP.C17
+3.3V: EXP.A4 EXP.B4 EXP.C4
+12V [LED power]: EXP.A31 EXP.B31 EXP.C31
AB0: EXP.A5 ; also sheet 3,4
AB1: EXP.A6 ; also sheet 3,4
AB2: EXP.A7 ; also sheet 3,4
AB3: EXP.A8 ; also sheet 3,4
AB4: EXP.A9 ; also sheet 3,4
AB5: EXP.A10 ; also sheet 3,4
AB6: EXP.A11 ; also sheet 3,4
AB7: EXP.A12 ; also sheet 3,4
AB8: EXP.A20 ; also sheet 4
AB9: EXP.A21 ; also sheet 4
AB10: EXP.A22 ; also sheet 4
AB11: EXP.A23 ; also sheet 4
AB12: EXP.A24 ; also sheet 4
AB13: EXP.A25 ; also sheet 4
AB14: EXP.A26 ; also sheet 4
AB15: EXP.A27 ; also sheet 4
AEXT0: EXP.B13 ; also sheet 4
AEXT1: EXP.B14 ; also sheet 4
AEXT2: EXP.B15 ; also sheet 4
AEXT3: EXP.B16 ; also sheet 4
AEXT4: EXP.B17 ; also sheet 4
AEXT5: EXP.B18 ; also sheet 4
AEXT6: EXP.B19 ; also sheet 4
AEXT7: EXP.B20 ; also sheet 4
CLK1: EXP.A29 ; also sheet 4
CLK2: EXP.B29 ; also sheet 4
CLK3: EXP.B30 ; also sheet 4
CLK4: EXP.B28 ; also sheet 2,4
DB0: EXP.C5 ; also sheet 4
DB1: EXP.C6 ; also sheet 4
DB2: EXP.C7 ; also sheet 4
DB3: EXP.C8 ; also sheet 4
DB4: EXP.C9 ; also sheet 4
DB5: EXP.C10 ; also sheet 4
DB6: EXP.C11 ; also sheet 4
DB7: EXP.C12 ; also sheet 4
DB8: EXP.C21 ; also sheet 4
DB9: EXP.C22 ; also sheet 4
DB10: EXP.C23 ; also sheet 4
DB11: EXP.C24 ; also sheet 4
DB12: EXP.C25 ; also sheet 4
DB13: EXP.C26 ; also sheet 4
DB14: EXP.C27 ; also sheet 4
DB15: EXP.C28 ; also sheet 4
GND [low power]: C31.- C32.- EXP.A1 EXP.A2 EXP.B1 EXP.B2 EXP.C1 EXP.C2 ; also sheet 2,3,4
VCC [low power]: C31.+ C32.+ EXP.A3 EXP.A32 EXP.B3 EXP.B32 EXP.C3 EXP.C32 ; also sheet 2,3,4
Unconnected: EXP.B5 EXP.B9 EXP.B10 EXP.B11 EXP.B12 EXP.B21 EXP.B22 EXP.B23

### Notes on the sheet
- Expansion Bus (computer bus)
- (1) | (1) | (1)
- (3)
- (3)
- (3)
- (3)
- (3)
- (2) | (2)
- (3)
- (3)
- (3)
- (5)
- PCB @ (0, 1.95) | (4)
- Notes
- (1) This pin is connected to a bus bar for power distribution, but the CFT does not (yet) require it.
- It's likely to be connected to another voltage level like +3.3V for easier interfacing. Reserved for now.
- (2) Pins *TPA and *TPC are not bussed. They are locally connected to each card's corresponding
- test pins (A17 & C17) to serve as test points.
- (3) Reserved for future expansion
- (4) Cheaper, 64-pin A+C row DIN41662 Type C plugs may be used for most expansion cards.
- (5) !IRQ! is provided for systems which lack an interrupt controller (!IRQ0-7!)
- @(0.15, 3.675) | @(5.775, 3.675)
- D
- @(0.15, 0.25) | @(5.775, 0.25)

## Power pins joined to a net without a drawn wire
GND: IC1.3(GND) IC2.3(GND) IC3.8(GND) IC4.16(GND) IC5.3(GND) IC6.16(GND) IC7.16(GND) IC8.3(GND) IC9.8(GND) IC10.8(GND) IC11.8(GND) IC12.7(P:GND) IC13.8(GND) IC14.8(GND) IC15.4(GND) IC15.10(GND) IC15.15(GND) IC15.21(GND) IC15.28(GND) IC15.34(GND) IC15.39(GND) IC15.45(GND) IC16.4(GND) IC16.10(GND) IC16.15(GND) IC16.21(GND) IC16.28(GND) IC16.34(GND) IC16.39(GND) IC16.45(GND) IC17.5(GND) IC17.6(GND) IC18.5(GND) IC18.6(GND) IC19.4(GND) IC19.10(GND) IC19.15(GND) IC19.21(GND) IC19.28(GND) IC19.34(GND) IC19.39(GND) IC19.45(GND) IC20.5(GND) IC20.6(GND) IC21.3(GND) IC21.4(GND)
VCC: IC1.5(VCC) IC2.5(VCC) IC3.16(VCC) IC4.32(VCC) IC5.5(VCC) IC6.32(VCC) IC7.32(VCC) IC8.5(VCC) IC9.16(VCC) IC10.16(VCC) IC11.16(VCC) IC12.14(P:VCC) IC13.16(VCC) IC14.16(VCC) IC15.7(VCC) IC15.18(VCC) IC15.31(VCC) IC15.42(VCC) IC16.7(VCC) IC16.18(VCC) IC16.31(VCC) IC16.42(VCC) IC17.15(VCC) IC17.16(VCC) IC18.15(VCC) IC18.16(VCC) IC19.7(VCC) IC19.18(VCC) IC19.31(VCC) IC19.42(VCC) IC20.15(VCC) IC20.16(VCC) IC21.10(VCC) IC21.11(VCC)

## Library data of the parts
$4_37_$ = alexios:SIGNATURE: Soup signature
$4_39_$ = SparkFun:OSHW-LOGO: Open Source Hardware Logo This logo indicates the piece of hardware it is found on incorporates a OSHW license and/or adheres to the definition of open source hardware found here: http://freedomdefined.org/OSHW
$4_40_$ = alexios:QRCODE-*: Various QR codes in silkscreen.
C1-C30 = rcl:C-EU: CAPACITOR, European symbol
C31 C32 = rcl:CPOL-EU: POLARIZED CAPACITOR, European symbol
EXP = alexios-19inch:VG96-3: PCB EUROCARD, 96-pin type C/ABC, 2.54 mm
IC1 IC8 = alexios:74*1G32: 2-input OR gate
IC2 = alexios:74*1G08: 2-input AND gate
IC3 = alexios:74*161: 4-Bit Synchronous Binary Counter. 4-bit synchronous binary counter with asynchronous reset. The ?AC163 devices are 4-bit binary counters. These synchronous, presettable counters feature an internal carry look-ahead for application in high-speed counting designs. Synchronous operation is provided by having all flip-flops clocked simultaneously so that the outputs change, coincident with each other, when instructed by the count-enable (ENP, ENT) inputs and internal gating.
IC4 IC6 IC7 = alexios:29F040: 4-mbit (512x8) Flash memory in a PLCC32 package (with socket). AM29F040 is an example of this.
IC5 = alexios:74*1G00: 2-input NAND gate
IC9 = alexios:74*138: 3-line to 8-line DECODER/DEMULTIPLEXER
IC10 IC11 IC14 = alexios:74*175: Qadruple D type FLIP FLOP, clear
IC12 = alexios:74*74: Dual D type positive edge triggered FLIP FLOP, preset and clear
IC13 = alexios:74*157/ALT-: Quadruple 2-line to 1-line data SELECTOR/MULTIPLEXER
IC15 IC16 IC19 = alexios:74*16244: 16-bit BUFFER/LINE DRIVER, 3-state Datasheet <http://www.ti.com/lit/ds/scds168/scds168.pdf>
IC17 IC18 IC20 = alexios:SN74ACT1073: SN74ACT1073 16-Bit Bus-Termination Array with Bus-Hold Function Datasheet <http://www.ti.com/lit/ds/symlink/sn74act1073.pdf>
IC21 = alexios:SN74ACT1071: 10-BIT BUS-TERMINATION ARRAY WITH BUS-HOLD FUNCTION Datasheet: http://www.ti.com/lit/ds/scas192/scas192.pdf
P1 P2 = con-3m:2540-: 3M (TM) Pak 100 4-Wall Header Source: 3M; OC_FARNELL: 9838414; OC_NEWARK: unknown
R1 R2 R4 = resistor:R-EU_: RESISTOR, European symbol
R3 R5 = rcl:R-EU_: RESISTOR, European symbol
RN1-RN14 = resistor-net:CTS742C083: Chip Resistor Array 4 Single Resistor Source: http://www.ctscorp.com/components/Datasheets/CTSChipArrayDs.pdf; OC_FARNELL: unknown; OC_NEWARK: unknown
SJ1-SJ5 = SparkFun:SOLDERJUMPER-OLD: Solder Jumper Standard SMD solder jumper. Used to automate production. Two varients : Normally Open and Normally Closed are the same, but have different paste layers. NC will have a large amount of paste and should jumper during reflow.
U1-U4 = alexios:HOLE: Hole for a standoff or mount. Hole diameter: 3.3mm. External Diameter: 6mm. Suitable for M3 standoffs.

## Net classes
0 default: width 0.203 mm, clearance 0.152 mm
1 low power: width 0.203 mm, clearance 0.152 mm
2 LED power: width 1.93 mm, clearance 0.152 mm